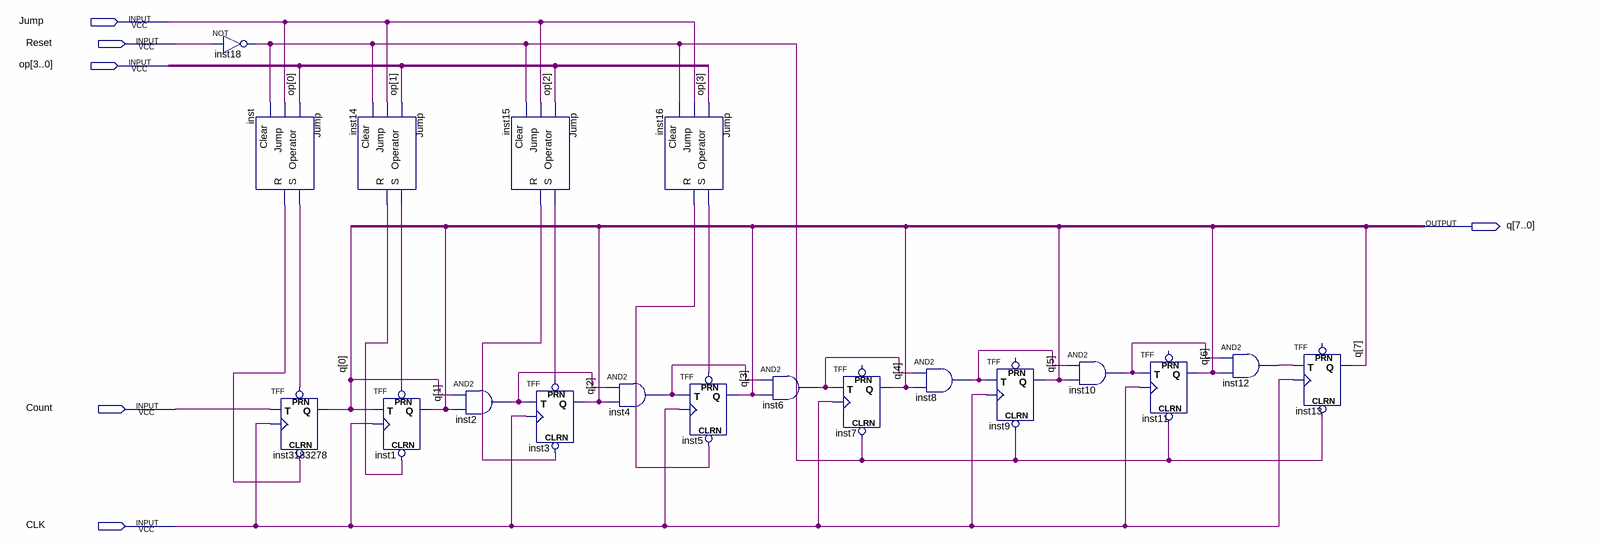
[diagram p0: schematic sheet]
// Quartus schematic Contador.bdf as structural Verilog: 19 symbols, 6 pins
module Contador (
  input  Jump,
  input  Reset,
  input  [3:0] op,
  input  Count,
  input  CLK,
  output [7:0] q
);

  wire inst2_out, inst4_out, inst6_out, inst8_out, inst10_out, inst12_out, inst14_r, inst14_s, inst15_r,
       inst15_s, inst16_r, inst16_s, inst18_out, inst_r, inst_s;

  not inst18 (inst18_out, Reset);
  Jump inst (.Operator(op[0]), .Jump(Jump), .Clear(inst18_out), .S(inst_s), .R(inst_r));
  TFF inst3183278 (.PRN(inst_s), .CLRN(inst_r), .T(Count), .CLK(CLK), .Q(q[0]));
  Jump inst14 (.Operator(op[1]), .Jump(Jump), .Clear(inst18_out), .S(inst14_s), .R(inst14_r));
  TFF inst1 (.PRN(inst14_s), .CLRN(inst14_r), .T(q[0]), .CLK(CLK), .Q(q[1]));
  and inst2 (inst2_out, q[0], q[1]);
  Jump inst15 (.Operator(op[2]), .Jump(Jump), .Clear(inst18_out), .S(inst15_s), .R(inst15_r));
  TFF inst3 (.PRN(inst15_s), .CLRN(inst15_r), .T(inst2_out), .CLK(CLK), .Q(q[2]));
  and inst4 (inst4_out, inst2_out, q[2]);
  Jump inst16 (.Operator(op[3]), .Jump(Jump), .Clear(inst18_out), .S(inst16_s), .R(inst16_r));
  TFF inst5 (.PRN(inst16_s), .CLRN(inst16_r), .T(inst4_out), .CLK(CLK), .Q(q[3]));
  and inst6 (inst6_out, inst4_out, q[3]);
  TFF inst7 (.CLRN(inst18_out), .T(inst6_out), .CLK(CLK), .Q(q[4]));  // open: PRN
  and inst8 (inst8_out, inst6_out, q[4]);
  TFF inst9 (.CLRN(inst18_out), .T(inst8_out), .CLK(CLK), .Q(q[5]));  // open: PRN
  and inst10 (inst10_out, inst8_out, q[5]);
  TFF inst11 (.CLRN(inst18_out), .T(inst10_out), .CLK(CLK), .Q(q[6]));  // open: PRN
  and inst12 (inst12_out, inst10_out, q[6]);
  TFF inst13 (.CLRN(inst18_out), .T(inst12_out), .CLK(CLK), .Q(q[7]));  // open: PRN
endmodule
